# Altium schematic sheet ToneReal_Adapter.SchDoc
size A3
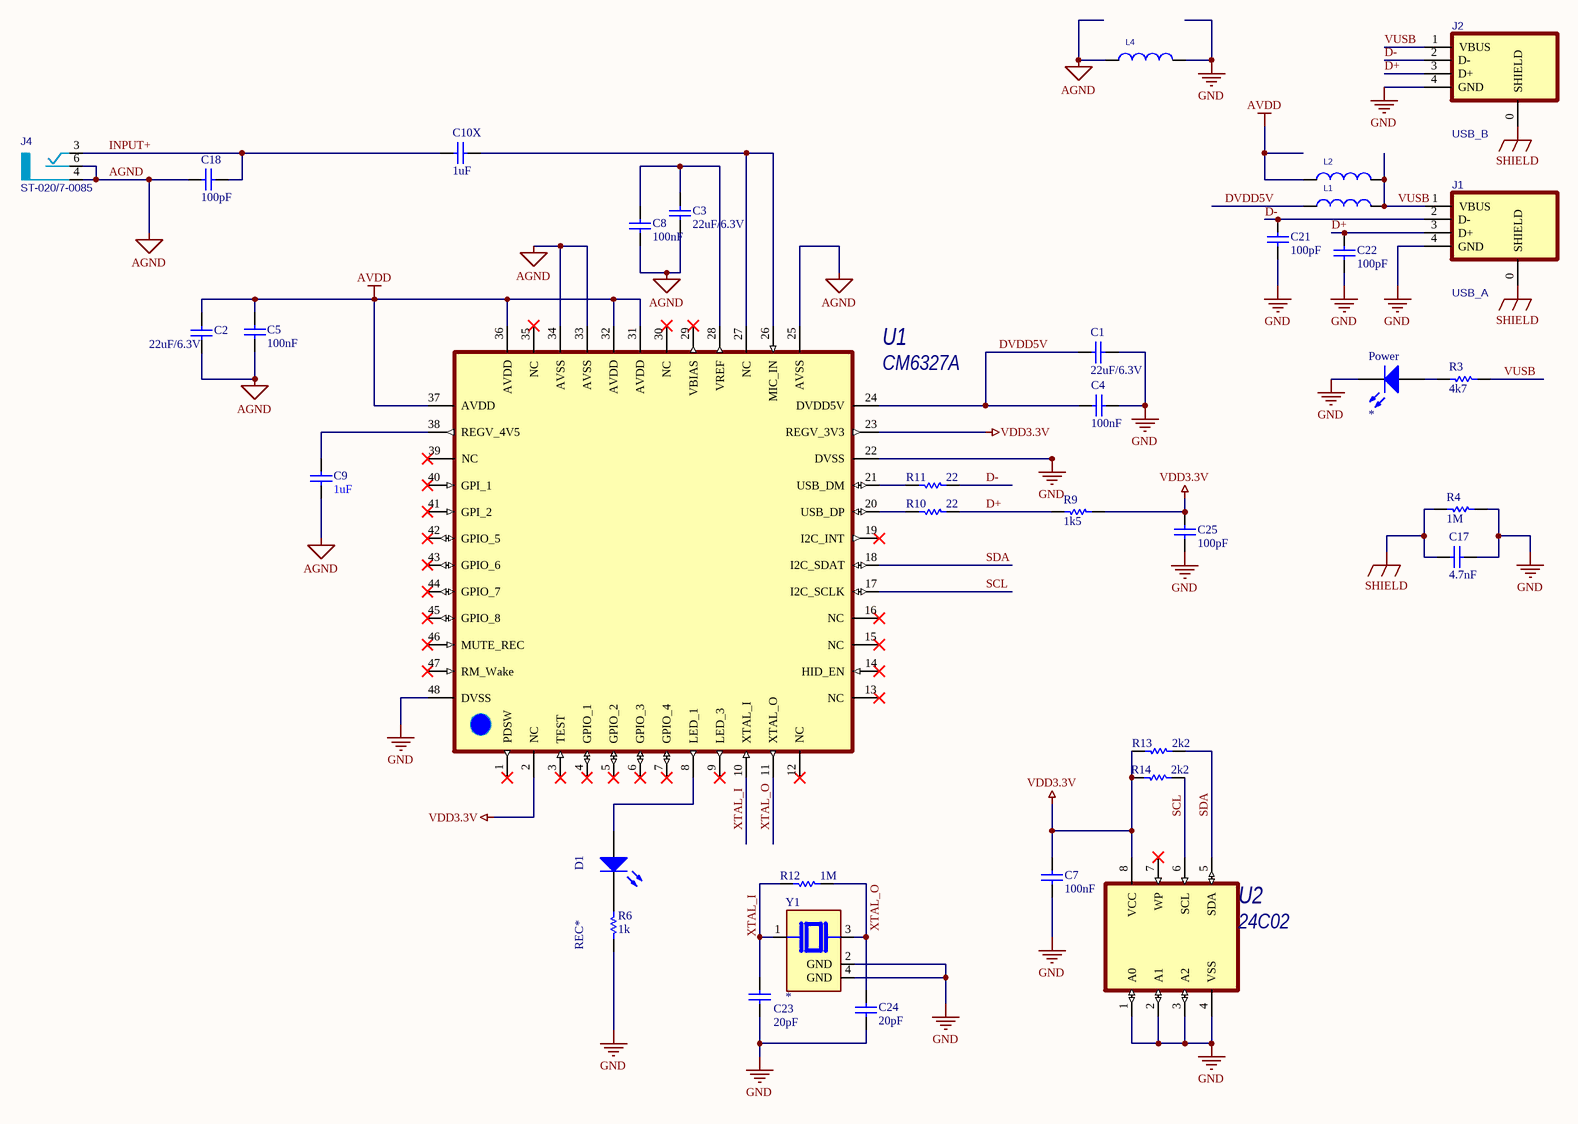
[diagram p0: ToneReal_Adapter.SchDoc]

## Parts
C1  22uF/6.3V  [CERCAP SMD0805 (IPC-2012)]
C2  22uF/6.3V  [CERCAP SMD0805 (IPC-2012)]
C3  22uF/6.3V  [CERCAP SMD0805 (IPC-2012)]
C4  100nF  [CERCAP SMD0603L (IPC1608L)]
C5  100nF  [CERCAP SMD0603L (IPC1608L)]
C7  100nF  [CERCAP SMD0603L (IPC1608L)]
C8  100nF  [CERCAP SMD0603L (IPC1608L)]
C9  1uF  [CERCAP SMD0603L (IPC1608L)]
C10X  1uF  [CERCAP SMD0805 (IPC-2012)]
C17  4.7nF  [CERCAP SMD0603L (IPC1608L)]
C18  100pF  [CERCAP SMD0603L (IPC1608L)]
C21  100pF  [CERCAP SMD0603L (IPC1608L)]
C22  100pF  [CERCAP SMD0603L (IPC1608L)]
C23  20pF  [CERCAP SMD0603L (IPC1608L)]
C24  20pF  [CERCAP SMD0603L (IPC1608L)]
C25  100pF  [CERCAP SMD0603L (IPC1608L)]
D1  REC*  [SMDLED_0805]
J1  USB_A  [USBA_1PLAG_NO_3D]
J2  USB_B  [USB-B]
J4  ST-020/7-0085  [JACK6.3 - duplicate]
L1  BLM21PG221SN1  [BLM18P (0603L SIZE)]  (value not drawn)
L2  BLM21PG221SN1  [BLM18P (0603L SIZE)]  (value not drawn)
L4  BLM21PG221SN1  [BLM18P (0603L SIZE)]  (value not drawn)
Power  *  [SMDLED_0805]
R3  4k7  [RES smd0603 (IPC-1608)]
R4  1M  [RES smd0603 (IPC-1608)]
R6  1k  [RES smd0603 (IPC-1608)]
R9  1k5  [RES smd0603 (IPC-1608)]
R10  22  [RES smd0603 (IPC-1608)]
R11  22  [RES smd0603 (IPC-1608)]
R12  1M  [RES smd0603 (IPC-1608)]
R13  2k2  [RES smd0603 (IPC-1608)]
R14  2k2  [RES smd0603 (IPC-1608)]
U1  CM6327A  [QFP50P900X900X160-48N]
U2  24C02  [SOIC-8]
Y1  *  [XTAL_3225]

## Nets
AGND: C2.2 C3.2 C5.2 C8.2 C9.2 C18.2 J4.4(GND) J4.6(R_ch_closed) L4.1 U1.25(AVSS) U1.33(AVSS) U1.34(AVSS)
AVDD: C2.1 C5.1 L2.1 U1.31(AVDD) U1.32(AVDD) U1.36(AVDD) U1.37(AVDD)
GND: C1.1 C4.1 C7.1 C17.2 C21.1 C22.1 C23.1 C24.1 C25.1 J1.4(GND) J2.4(GND) L4.2 Power.1(K) R4.1 R6.2 U1.22(DVSS) U1.48(DVSS) U2.1(A0) U2.2(A1) U2.3(A2) U2.4(VSS) Y1.2(GND) Y1.4(GND)
SHIELD: C17.1 J1.0(SHIELD) J2.0(SHIELD) R4.2
VDD3.3V: C7.2 C25.2 R9.1 R13.1 R14.1 U1.2(NC) U1.23(REGV_3V3) U2.8(VCC)
D+: C22.2 J1.3(D+) J2.3(D+) R9.2 R10.2
D-: C21.2 J1.2(D-) J2.2(D-) R11.2
DVDD5V: C1.2 C4.2 L1.1 U1.24(DVDD5V)
INPUT+: C10X.1 C18.1 J4.3(R_CH)
SCL: R14.2 U1.17(I2C_SCLK) U2.6(SCL)
SDA: R13.2 U1.18(I2C_SDAT) U2.5(SDA)
VUSB: J1.1(VBUS) J2.1(VBUS) L1.2 L2.2 R3.1
XTAL_I: C23.2 R12.1 U1.10(XTAL_I) Y1.1
XTAL_O: C24.2 R12.2 U1.11(XTAL_O) Y1.3
NetC3_1: C3.1 C8.1 U1.28(VREF)
NetC9_1: C9.1 U1.38(REGV_4V5)
NetC10X_2: C10X.2 U1.26(MIC_IN) U1.27(NC)
NetD1_1: D1.1(K) R6.1
NetD1_2: D1.2(A) U1.8(LED_1)
NetPower_2: Power.2(A) R3.2
NetR10_1: R10.1 U1.20(USB_DP)
NetR11_1: R11.1 U1.21(USB_DM)

Not connected (* = marked no-connect by the designer): U1 1(PDSW)* 3(TEST)* 4(GPIO_1)* 5(GPIO_2)* 6(GPIO_3)* 7(GPIO_4)* 9(LED_3)* 12(NC)* 13(NC)* 14(HID_EN)* 15(NC)* 16(NC)* 19(I2C_INT)* 29(VBIAS)* 30(NC)* 35(NC)* 39(NC)* 40(GPI_1)* 41(GPI_2)* 42(GPIO_5)* 43(GPIO_6)* 44(GPIO_7)* 45(GPIO_8)* 46(MUTE_REC)* 47(RM_Wake)*; U2 7(WP)*

## Library data of the parts
C1-C5 C7-C9 C10X C17 C18 C21-C25 = Cap Semi: Capacitor (Semiconductor SIM Model); Published: 8-Jun-2000; LatestRevisionDate: 29-May-2009; LatestRevisionNote: IPC-7351 Footprint Added.; PackageReference: C1206; Publisher: Altium Limited; PackageDescription: Chip Capacitor
  C1-C3: Value: 22uF/6.3V
  C4 C5 C7 C8: Value: 100nF
  C9 C10X: Value: 1uF
  C17: Value: 4.7nF
  C18 C21 C22 C25: Value: 100pF
  C23 C24: Value: 20pF
D1 Power = LED0: Typical INFRARED GaAs LED; Published: 8-Jun-2000; LatestRevisionDate: 08-Jul-2005; LatestRevisionNote: Mech Layer 1 removed.; PackageReference: LED-0; Publisher: Altium Limited
J1 J2 = USB: BOM_Manufacturer: SOFNG; BOM_Manufacturer Part: USB-B01; Contributor: LCSC; BOM_Supplier: LCSC; BOM_Supplier Part: C498173; BOM_JLCPCB Part Class: Extended Part; spicePre: U; spiceSymbolName: USB-B01
J4 = JACK6.3_MONO_R: spicePre: U; spiceSymbolName: JACK6.3_MONO_R
L1 L2 L4 = INDUCT
R3 R4 R6 R9-R14 = RES: Resistor; comment2: smd 0805 1%; Published: 8-Jun-2000; LatestRevisionDate: 17-Jul-2002; LatestRevisionNote: Re-released for DXP Platform.; PackageReference: AXIAL-0.3; Publisher: Altium Limited
  R3: Value: 4k7
  R4 R12: Value: 1M
  R6: Value: 1k
  R9: Value: 1k5
  R10 R11: Value: 22
  R13 R14: Value: 2k2
U1 = CM6327_1: CM6327
Y1 = TSX-3225: 3225; Value: *